# EAGLE design BeagleWire - CR7CSZ (EAGLE 9.1.3)
LICENSE: CERN OHL v1.2; REV: CR7CSZ; TITLE: BeagleWire to PMOD; URL: https://github.com/CapableRobot/PMOD-Adapters
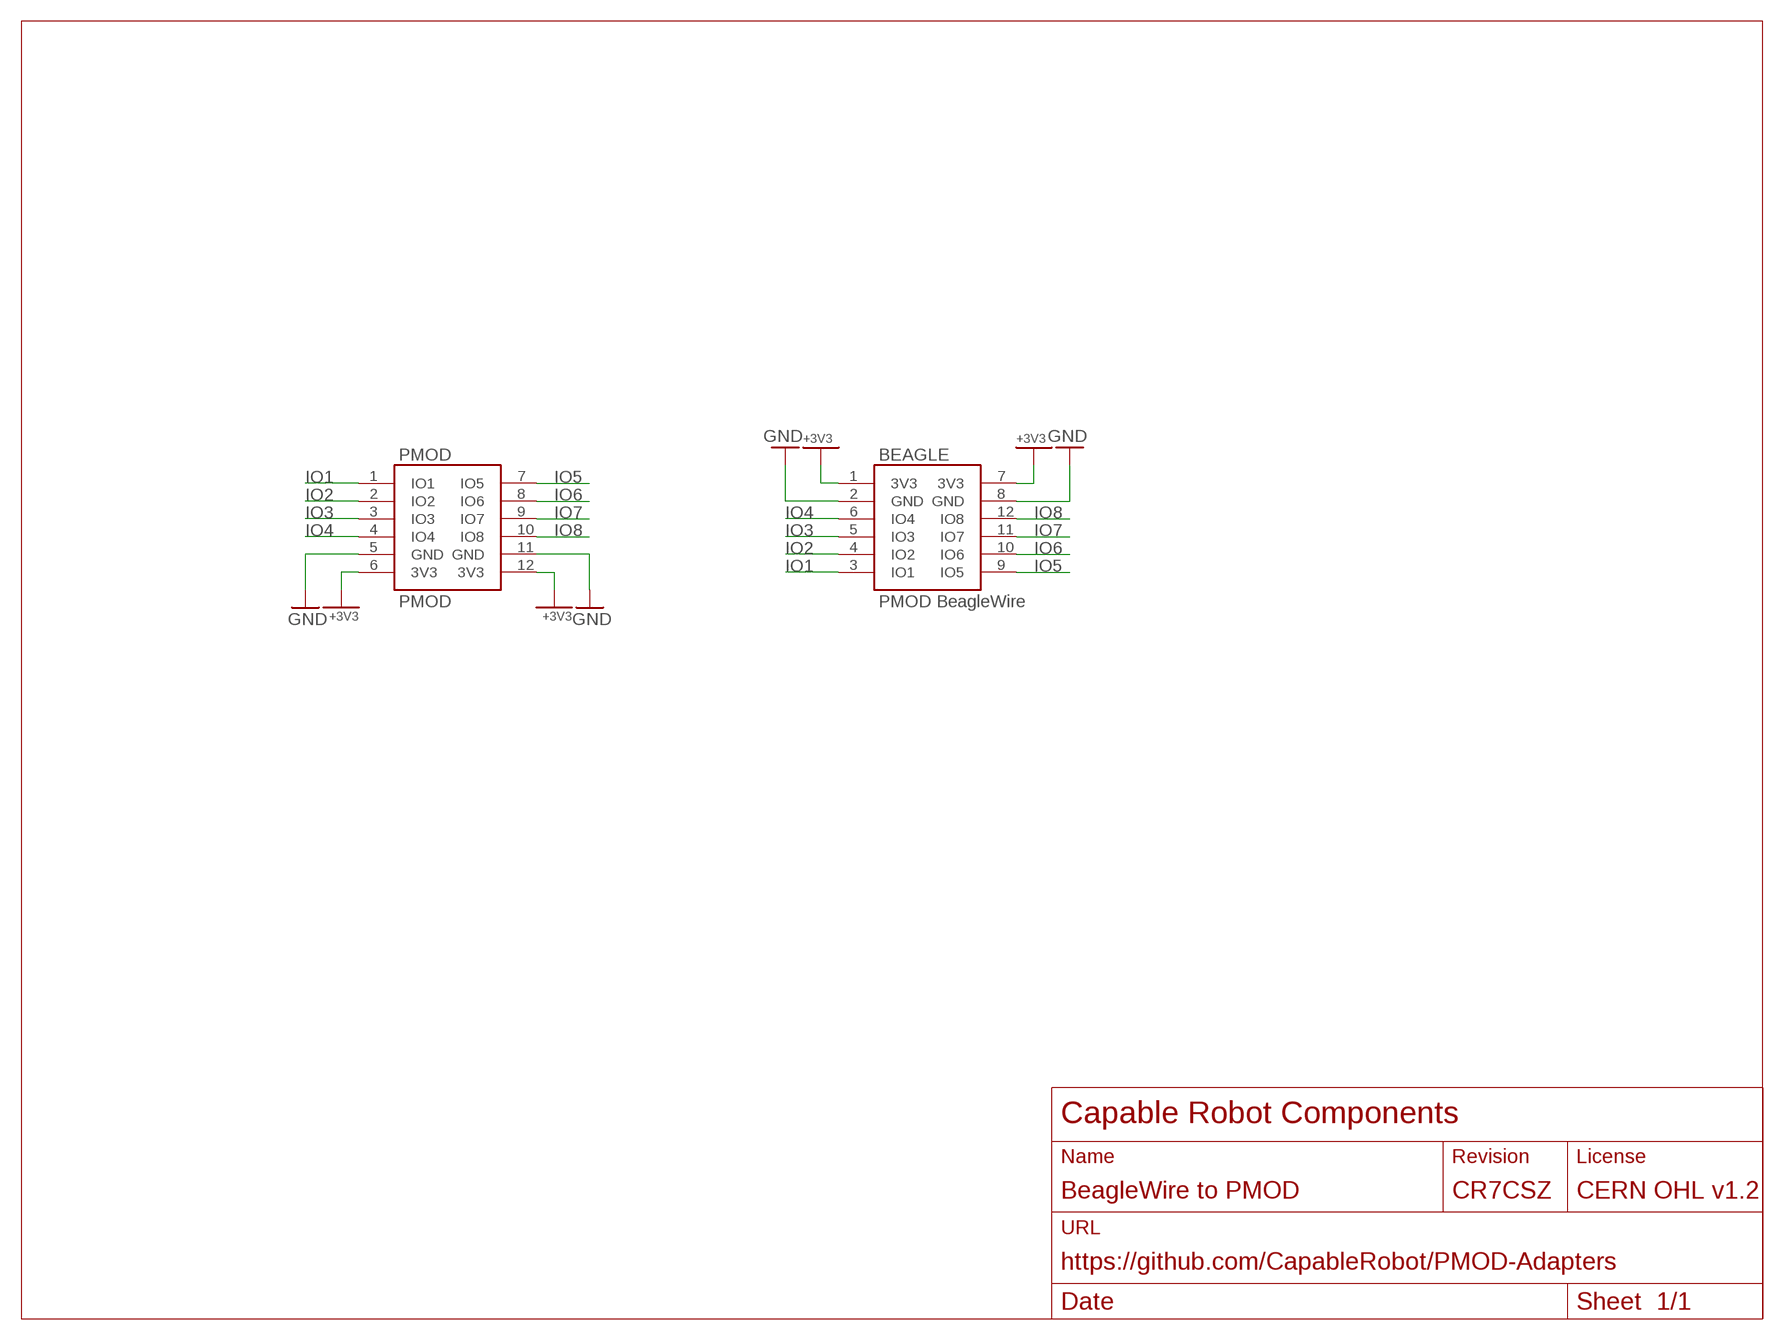
[diagram p0: schematic, sheet 1]

## Parts
BEAGLE  PMOD-BEAGLEWIRE  [HDRRA12W64P254_2X6_1524X254X556B]
PMOD  PMOD-HOST  [HDRRAR12W64P254_2X6_1524X736X556B]

## Nets
+3V3: BEAGLE.1(3V3) BEAGLE.7(3V3) PMOD.6(3V3) PMOD.12(3V3)
GND: BEAGLE.2(GND) BEAGLE.8(GND) PMOD.5(GND) PMOD.11(GND)
IO1: BEAGLE.3(IO1) PMOD.1(IO1)
IO2: BEAGLE.4(IO2) PMOD.2(IO2)
IO3: BEAGLE.5(IO3) PMOD.3(IO3)
IO4: BEAGLE.6(IO4) PMOD.4(IO4)
IO5: BEAGLE.9(IO5) PMOD.7(IO5)
IO6: BEAGLE.10(IO6) PMOD.8(IO6)
IO7: BEAGLE.11(IO7) PMOD.9(IO7)
IO8: BEAGLE.12(IO8) PMOD.10(IO8)

## Library data of the parts
BEAGLE = CapableRobot:PMOD-BEAGLEWIRE
PMOD = CapableRobot:PMOD

## Board
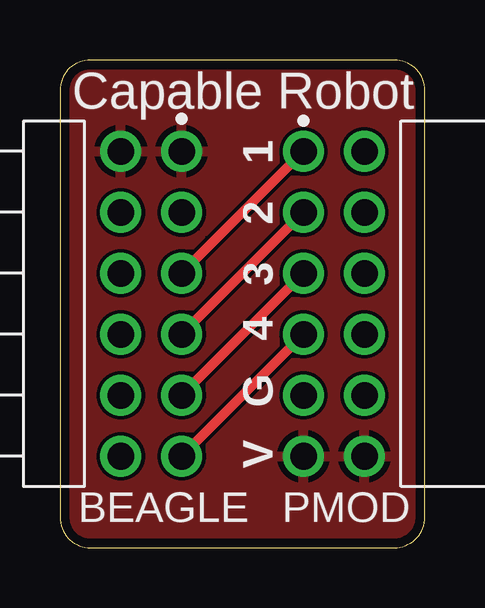
[diagram p1: board, top side]
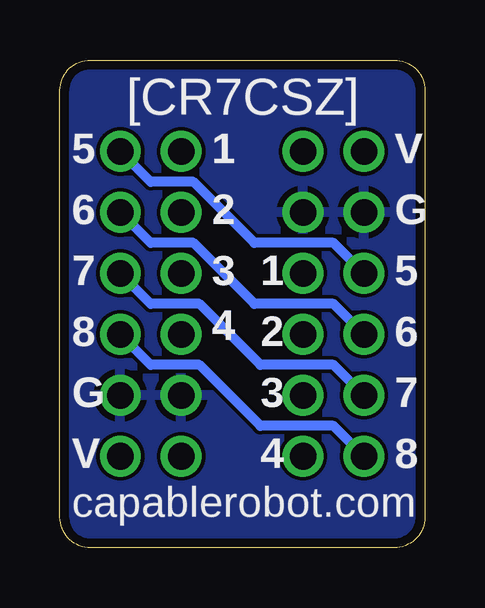
[diagram p2: board, bottom side, seen from below]

Size 15.22 x 20.32 mm. Coordinates in mm from the lower left corner, seen from the top.
Outline: 13.95,20.32 1.27,20.32 arc90 0,19.05 0,1.27 arc90 1.27,0 13.95,0 arc90 15.22,1.27 15.22,19.05 arc90 13.95,20.32
Copper layers (1*16): Top 0.035559375mm / dielectric 1.6mm / Bottom 0.035559375mm
Design rules "oshpark-2layer": minimum track width 6mil, minimum drill 10mil, track to track 6mil, track to pad 6mil, pad to pad 6mil, via to via 6mil, smd to smd 6mil, copper to edge 15mil, drill to drill 6mil, minimum pad ring 5mil, minimum via ring 5mil, stop-mask expansion 2.5mil, vias tented up to drill 0mil, thermal gap 10mil

### Footprints (pad centres in the part's own frame; a part is rotated, then mirrored left to right if it is on the bottom)
HDRRA12W64P254_2X6_1524X254X556B = drill 1.105 pad 1.705: 1 0,0; 2 2.54,0; 3 5.08,0; 4 7.62,0; 5 10.16,0; 6 12.7,0; 7 0,-2.54; 8 2.54,-2.54; 9 5.08,-2.54; 10 7.62,-2.54; 11 10.16,-2.54; 12 12.7,-2.54
HDRRAR12W64P254_2X6_1524X736X556B = drill 1.105 pad 1.705: 1 12.7,0; 2 10.16,0; 3 7.62,0; 4 5.08,0; 5 2.54,0; 6 0,0; 7 12.7,-2.54; 8 10.16,-2.54; 9 7.62,-2.54; 10 5.08,-2.54; 11 2.54,-2.54; 12 0,-2.54

### Placement (x,y rotation side)
BEAGLE  5.08,16.51 270 top
PMOD  10.16,3.81 90 top

### Tracks (layer width: path | path; a pad name or v marks a point on that pad's centre or on a via)
+3V3
  pour Top: 0,20.32 15.24,20.32 15.24,0 0,0
GND
  pour Bottom: 0,20.32 15.24,20.32 15.24,0 0,0
IO1
  Top 0.406: BEAGLE.3 PMOD.1
IO2
  Top 0.406: BEAGLE.4 PMOD.2
IO3
  Top 0.406: BEAGLE.5 PMOD.3
IO4
  Top 0.406: BEAGLE.6 PMOD.4
IO5
  Bottom 0.406: BEAGLE.9 3.81,12.7 7.11,12.7 9.65,15.24 11.43,15.24 PMOD.7
IO6
  Bottom 0.406: BEAGLE.10 3.81,10.16 7.11,10.16 9.65,12.7 11.43,12.7 PMOD.8
IO7
  Bottom 0.406: BEAGLE.11 3.81,7.62 6.86,7.62 9.4,10.16 11.43,10.16 PMOD.9
IO8
  Bottom 0.406: BEAGLE.12 3.81,5.08 6.86,5.08 9.4,7.62 11.43,7.62 PMOD.10

### Text on the board
tPlace: Capable Robot | 1 | 2 | 3 | 4 | G | V
bPlace: [CR7CSZ] | V | 1 | 5 | G | 2 | 6 | 5 | 1 | 3 | 7 | 4 | 6 | 2 | 8 | 7 | 3 | G | 8 | 4 | V | capablerobot.com